# Altium schematic sheet rf_test_source_top.SchDoc: SPE Router (part 1 of 2)
size 420 x 297 mm; Author: P. Daniel; CompanyName: WUT ISE; DrawnBy: P. Daniel; Organization: WUT ISE; Address1: WUT ISE; Address2: Nowowiejska 15/19 00-665 Warsaw; Address3: piotrmaciejdaniel@gmail.com; Revision: 1; SheetNumber: 1; SheetTotal: 1; ModifiedBy: -; CreateDate: 02-03.2023; CheckedDate: -; Title2: top schematic; DivGrp: WUT ISE; Designer: Piotr Daniel
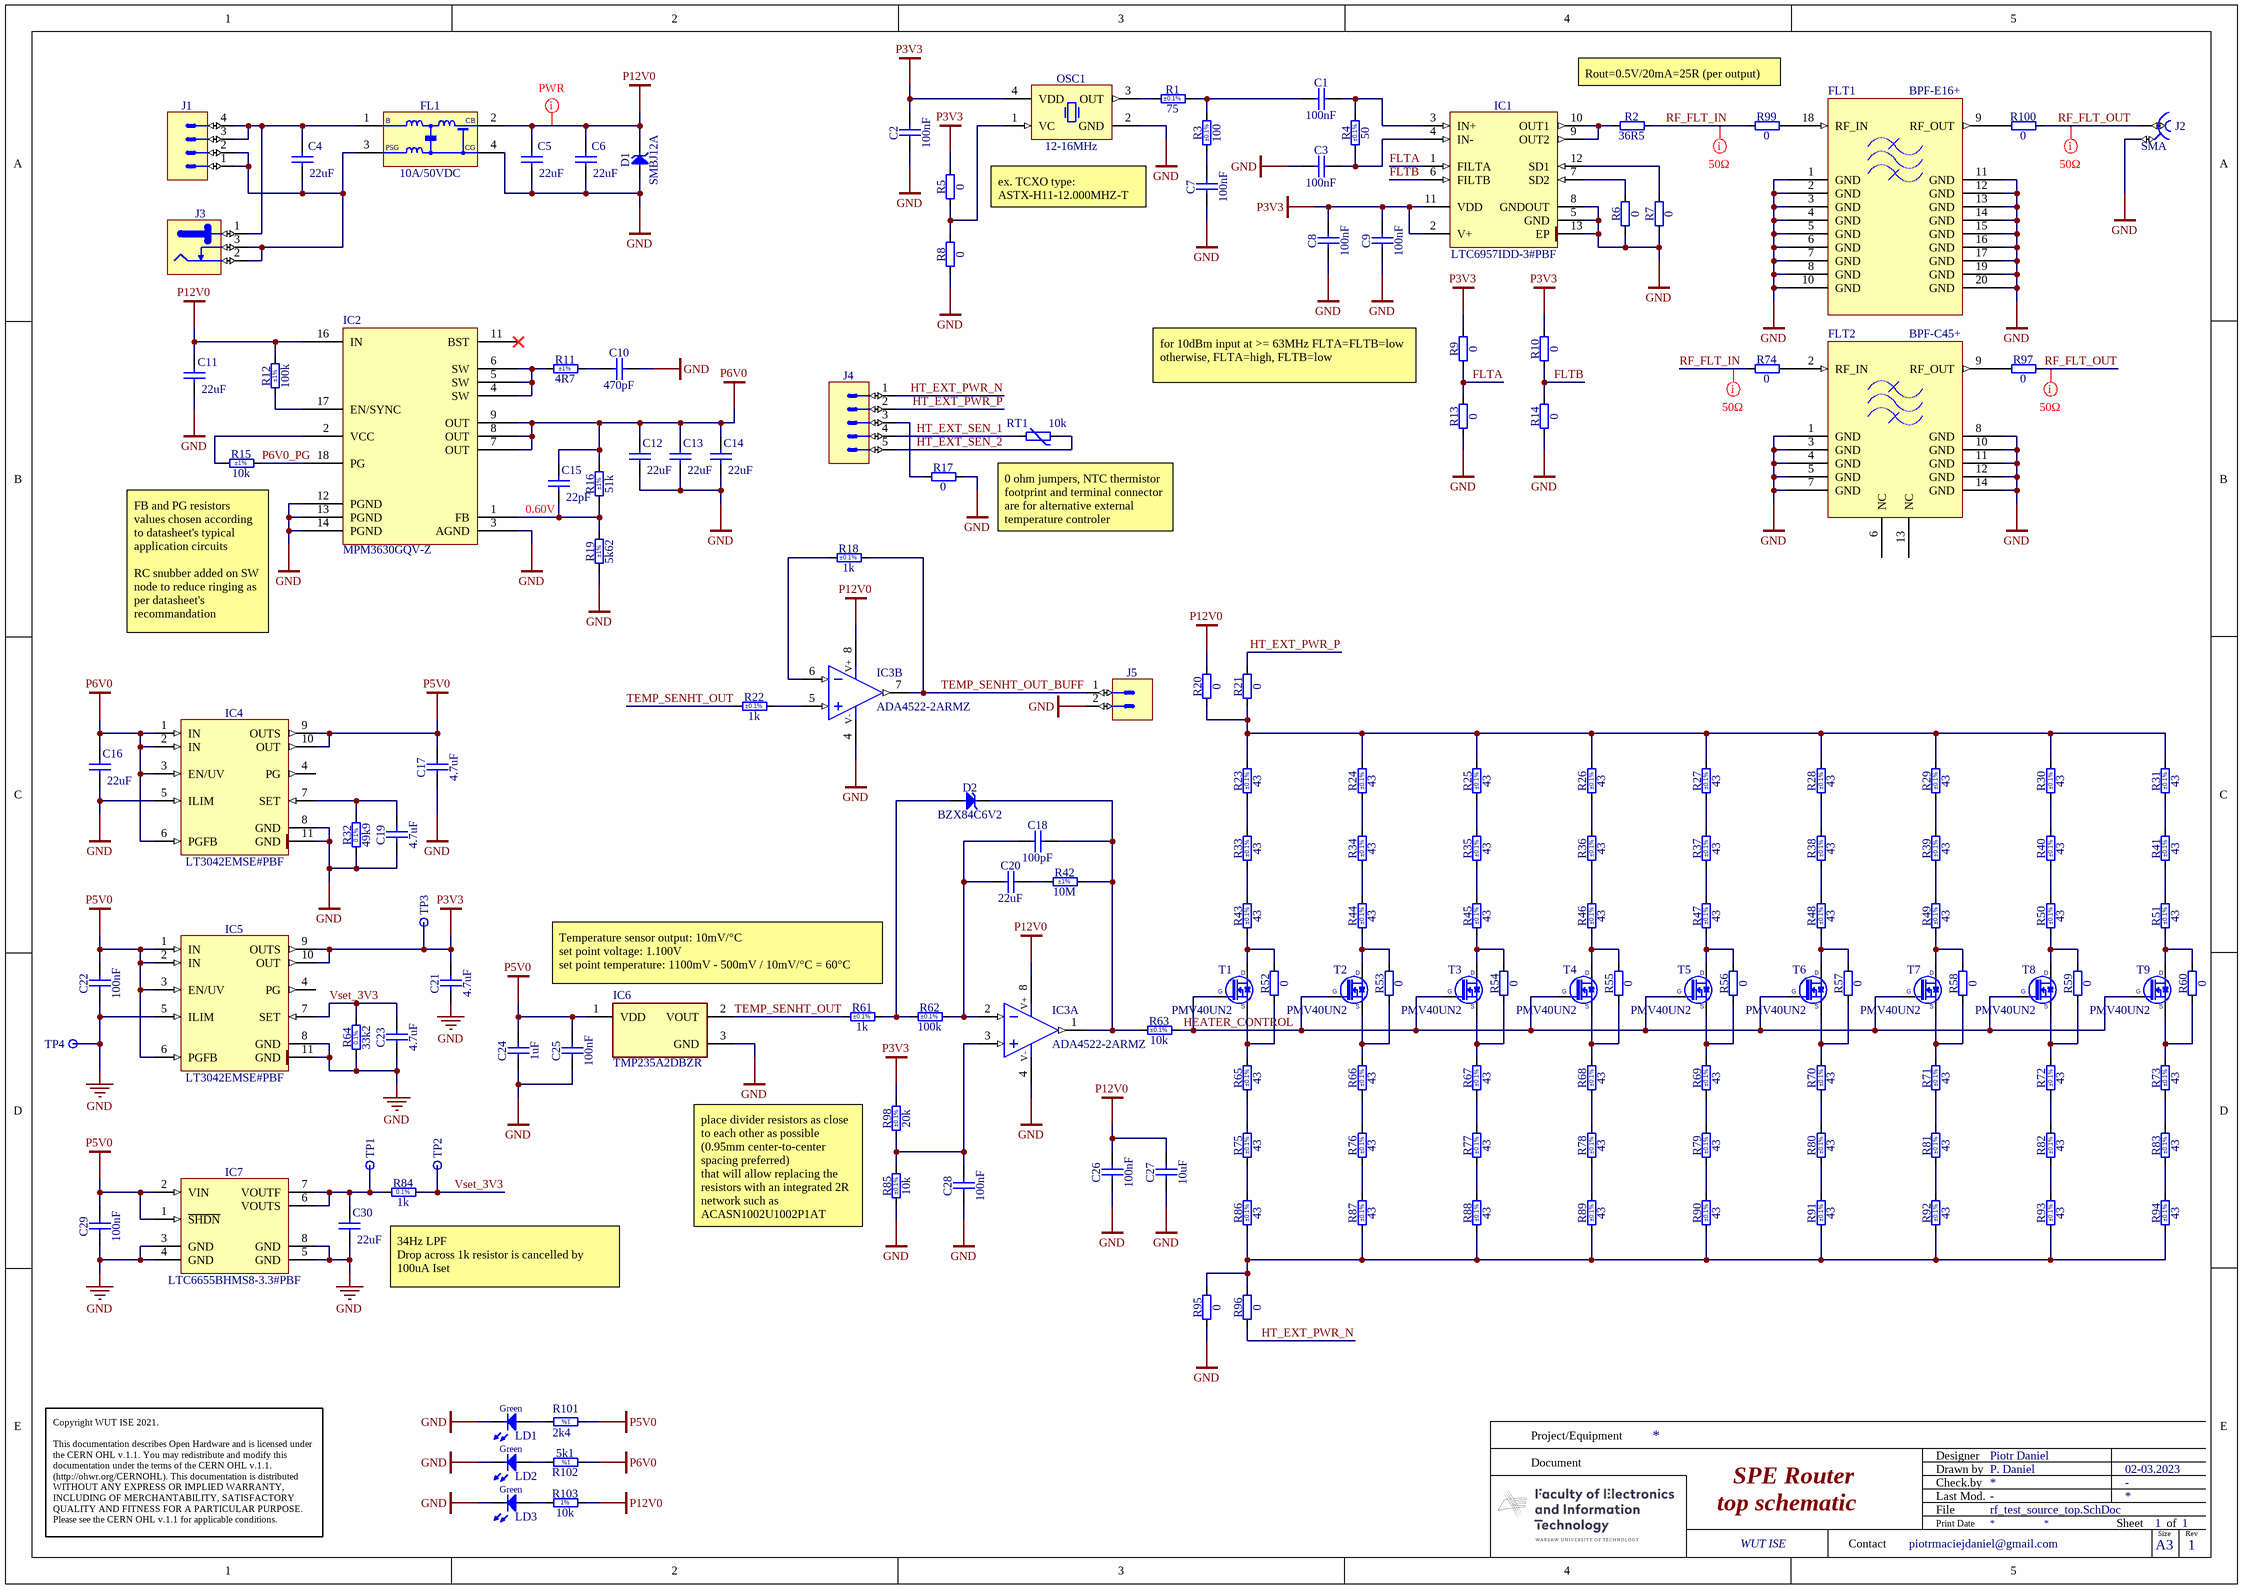
[diagram p0: rf_test_source_top.SchDoc]

## Parts
C1  100nF  [CAPC1608X87N]
C2  100nF  [CAPC1608X87N]
C3  100nF  [CAPC1608X87N]
C4  22uF  [CAPC3225X140N]
C5  22uF  [CAPC3225X140N]
C6  22uF  [CAPC3225X140N]
C7  100nF  [CAPC1608X87N]
C8  100nF  [CAPC1608X87N]
C9  100nF  [CAPC1608X87N]
C10  470pF  [CAPC1005X55N]
C11  22uF  [CAPC3225X140N]
C12  22uF  [CAPC3225X140N]
C13  22uF  [CAPC3225X140N]
C14  22uF  [CAPC3225X140N]
C15  22pF  [CAPC1005X55N]
C16  22uF  [CAPC3225X140N]
C17  4.7uF  [CAPC3216X180N]
C18  100pF  [CAPC1608X87N]
C19  4.7uF  [CAPC3216X180N]
C20  22uF  [CAPC2012X135N]
C21  4.7uF  [CAPC3216X180N]
C22  100nF  [CAPC1608X87N]
C23  4.7uF  [CAPC3216X180N]
C24  1uF  [CAPC1608X87N]
C25  100nF  [CAPC1005X55N]
C26  100nF  [CAPC1005X55N]
C27  10uF  [CAPC2012X135N]
C28  100nF  [CAPC1005X55N]
C29  100nF  [CAPC1608X87N]
C30  22uF  [CAPC3225X140N]
D1  SMBJ12A  [DIOM5336X265N]
D2  BZX84C6V2  [SOT95P248X115-3N]
FL1  10A/50VDC  [FIL_MURATA_BNX02]
FLT1  BPF-E16+  [HR1176]
FLT2  BPF-C45+  [HU1186]
IC1  LTC6957IDD-3#PBF  [SON45P300X300X80-13N-R175X248]
IC2  MPM3630GQV-Z  [MPM3610A]
IC3  ADA4522-2ARMZ  [SOP65P490X110-8N]  (parts A,B of 2)
IC4  LT3042EMSE#PBF  [SOP50P490X110-11N-R168X198]
IC5  LT3042EMSE#PBF  [SOP50P490X110-11N-R168X198]
IC6  TMP235A2DBZR  [FP-DBZ0003A-MFG]
IC7  LTC6655BHMS8-3.3#PBF  [SOP65P490X110-8N]
J1  Mini-Fit Jr.™  [MOLEX_39-30-0040]  (value not drawn)
J2  SMA  [MOLEX_73251-2121]
J3  Jack  [SWITCHCRAFT_712RA]  (value not drawn)
J4  (no value)  [PHOENIX_1803303]
J5  KK®  [MOLEX_22-05-7028]  (value not drawn)
LD1  Green  [LED_KINGBRIGHT_KPH-1608CGCK]
LD2  Green  [LED_KINGBRIGHT_KPH-1608CGCK]
LD3  Green  [LED_KINGBRIGHT_KPH-1608CGCK]
OSC1  12-16MHz  [OSC_TAITIEN_3.2X2.5X1.0]
R1  75  Tolerance: ±0.1%  [RESC1608X55N]
R2  36R5  [RESC1005X40N]
R3  100  Tolerance: ±0.1%  [RESC1608X64N]
R4  50  Tolerance: ±0.1%  [RES_VISHAY_FC0603]
R5  0  [RESC1608X55N]
R6  0  [RESC1608X55N]
R7  0  [RESC1608X55N]
R8  0  [RESC1608X55N]
R9  0  [RESC1608X55N]
R10  0  [RESC1608X55N]
R11  4R7  Tolerance: ±1%  [RESC1005X40N]
R12  100k  Tolerance: ±1%  [RESC1005X40N]
R13  0  [RESC1608X55N]
R14  0  [RESC1608X55N]
R15  10k  Tolerance: ±1%  [RESC1005X40N]
R16  51k  Tolerance: ±1%  [RESC1005X40N]
R17  0  [RESC2012X60N]
R18  1k  Tolerance: ±0.1%  [RESC1608X55N]
R19  5k62  Tolerance: ±1%  [RESC1005X40N]
R20  0  [RESC2012X60N]
R21  0  [RESC2012X60N]
R22  1k  Tolerance: ±0.1%  [RESC1608X55N]
R23  43  Tolerance: ±0.1%  [RESC3216X65N]
R24  43  Tolerance: ±0.1%  [RESC3216X65N]
R25  43  Tolerance: ±0.1%  [RESC3216X65N]
R26  43  Tolerance: ±0.1%  [RESC3216X65N]
R27  43  Tolerance: ±0.1%  [RESC3216X65N]
R28  43  Tolerance: ±0.1%  [RESC3216X65N]
R29  43  Tolerance: ±0.1%  [RESC3216X65N]
R30  43  Tolerance: ±0.1%  [RESC3216X65N]
R31  43  Tolerance: ±0.1%  [RESC3216X65N]
R32  49k9  [RESC1608X55N]
R33  43  Tolerance: ±0.1%  [RESC3216X65N]
R34  43  Tolerance: ±0.1%  [RESC3216X65N]
R35  43  Tolerance: ±0.1%  [RESC3216X65N]
R36  43  Tolerance: ±0.1%  [RESC3216X65N]
R37  43  Tolerance: ±0.1%  [RESC3216X65N]
R38  43  Tolerance: ±0.1%  [RESC3216X65N]
R39  43  Tolerance: ±0.1%  [RESC3216X65N]
R40  43  Tolerance: ±0.1%  [RESC3216X65N]
R41  43  Tolerance: ±0.1%  [RESC3216X65N]
R42  10M  Tolerance: ±1%  [RESC1608X55N]
R43  43  Tolerance: ±0.1%  [RESC3216X65N]
R44  43  Tolerance: ±0.1%  [RESC3216X65N]
R45  43  Tolerance: ±0.1%  [RESC3216X65N]
R46  43  Tolerance: ±0.1%  [RESC3216X65N]
R47  43  Tolerance: ±0.1%  [RESC3216X65N]
R48  43  Tolerance: ±0.1%  [RESC3216X65N]
R49  43  Tolerance: ±0.1%  [RESC3216X65N]
R50  43  Tolerance: ±0.1%  [RESC3216X65N]
R51  43  Tolerance: ±0.1%  [RESC3216X65N]
R52  0  [RESC1608X55N]
R53  0  [RESC1608X55N]
R54  0  [RESC1608X55N]
R55  0  [RESC1608X55N]
R56  0  [RESC1608X55N]
R57  0  [RESC1608X55N]
R58  0  [RESC1608X55N]
R59  0  [RESC1608X55N]
R60  0  [RESC1608X55N]
R61  1k  Tolerance: ±0.1%  [RESC1608X55N]
R62  100k  Tolerance: ±0.1%  [RESC1608X55N]
R63  10k  Tolerance: ±0.1%  [RESC1608X55N]
R64  33k2  [RESC1608X55N]
R65  43  Tolerance: ±0.1%  [RESC3216X65N]
R66  43  Tolerance: ±0.1%  [RESC3216X65N]
R67  43  Tolerance: ±0.1%  [RESC3216X65N]
R68  43  Tolerance: ±0.1%  [RESC3216X65N]
R69  43  Tolerance: ±0.1%  [RESC3216X65N]
R70  43  Tolerance: ±0.1%  [RESC3216X65N]
R71  43  Tolerance: ±0.1%  [RESC3216X65N]
R72  43  Tolerance: ±0.1%  [RESC3216X65N]
R73  43  Tolerance: ±0.1%  [RESC3216X65N]
R74  0  [RESC1005X40N]
R75  43  Tolerance: ±0.1%  [RESC3216X65N]
R76  43  Tolerance: ±0.1%  [RESC3216X65N]
R77  43  Tolerance: ±0.1%  [RESC3216X65N]
R78  43  Tolerance: ±0.1%  [RESC3216X65N]
R79  43  Tolerance: ±0.1%  [RESC3216X65N]
R80  43  Tolerance: ±0.1%  [RESC3216X65N]
R81  43  Tolerance: ±0.1%  [RESC3216X65N]
R82  43  Tolerance: ±0.1%  [RESC3216X65N]
R83  43  Tolerance: ±0.1%  [RESC3216X65N]
R84  1k  [RESC1608X55N]
R85  10k  Tolerance: ±0.1%  [RESC1608X55N]
R86  43  Tolerance: ±0.1%  [RESC3216X65N]
R87  43  Tolerance: ±0.1%  [RESC3216X65N]
R88  43  Tolerance: ±0.1%  [RESC3216X65N]
R89  43  Tolerance: ±0.1%  [RESC3216X65N]
R90  43  Tolerance: ±0.1%  [RESC3216X65N]
R91  43  Tolerance: ±0.1%  [RESC3216X65N]
R92  43  Tolerance: ±0.1%  [RESC3216X65N]
R93  43  Tolerance: ±0.1%  [RESC3216X65N]
R94  43  Tolerance: ±0.1%  [RESC3216X65N]
R95  0  [RESC2012X60N]
R96  0  [RESC2012X60N]
R97  0  [RESC1005X40N]
R98  20k  Tolerance: ±0.1%  [RESC1608X55N]
R99  0  [RESC1005X40N]
R100  0  [RESC1005X40N]
R101  2k4  [RESC1005X40N]
R102  5k1  [RESC1005X40N]
R103  10k  [RESC1005X40N]
RT1  10k  [THERMC1608X90N]
T1  PMV40UN2  [SOT95P230X110-3N]
T2  PMV40UN2  [SOT95P230X110-3N]
T3  PMV40UN2  [SOT95P230X110-3N]
T4  PMV40UN2  [SOT95P230X110-3N]
T5  PMV40UN2  [SOT95P230X110-3N]
T6  PMV40UN2  [SOT95P230X110-3N]
T7  PMV40UN2  [SOT95P230X110-3N]
T8  PMV40UN2  [SOT95P230X110-3N]
T9  PMV40UN2  [SOT95P230X110-3N]
TP1  Test Point  [TPS127]  (value not drawn)
TP2  Test Point  [TPS127]  (value not drawn)
TP3  Test Point  [TPS127]  (value not drawn)
TP4  Test Point  [TPS127]  (value not drawn)

## Nets
GND: C2.1 C3.1 C5.1 C6.1 C7.1 C8.1 C9.1 C10.2 C11.1 C12.1 C13.1 C14.1 C16.1 C17.1 C19.1 C21.1 C22.1 C23.1 C24.1 C25.1 C26.1 C27.1 C28.1 C29.1 C30.1 D1.2(A) FL1.4(CG) FLT1.1(GND) FLT1.2(GND) FLT1.3(GND) FLT1.4(GND) FLT1.5(GND) FLT1.6(GND) FLT1.7(GND) FLT1.8(GND) FLT1.10(GND) FLT1.11(GND) FLT1.12(GND) FLT1.13(GND) FLT1.14(GND) FLT1.15(GND) FLT1.16(GND) FLT1.17(GND) FLT1.19(GND) FLT1.20(GND) FLT2.1(GND) FLT2.3(GND) FLT2.4(GND) FLT2.5(GND) FLT2.7(GND) FLT2.8(GND) FLT2.10(GND) FLT2.11(GND) FLT2.12(GND) FLT2.14(GND) IC1.5(GND) IC1.8(GNDOUT) IC1.13(EP) IC2.3(AGND) IC2.12(PGND) IC2.13(PGND) IC2.14(PGND) IC3.4(V-) IC4.5(ILIM) IC4.8(GND) IC4.11(GND) IC5.5(ILIM) IC5.8(GND) IC5.11(GND) IC6.3(GND) IC7.3(GND) IC7.4(GND) IC7.5(GND) IC7.8(GND) J2.2 J5.2 LD1.1(C) LD2.1(C) LD3.1(C) OSC1.2(GND) R6.1 R7.1 R8.1 R13.1 R14.1 R17.2 R19.1 R32.1 R64.1 R85.1 R95.1 TP4.1
P3V3: C2.2 C8.2 C9.2 C21.2 IC1.2(V+) IC1.11(VDD) IC5.9(OUTS) IC5.10(OUT) OSC1.4(VDD) R5.2 R9.2 R10.2 R98.2 TP3.1
P5V0: C17.2 C22.2 C24.2 C25.2 C29.2 IC4.9(OUTS) IC4.10(OUT) IC5.1(IN) IC5.2(IN) IC5.3(EN/UV) IC5.6(PGFB) IC6.1(VDD) IC7.1(~{SHDN}) IC7.2(VIN) R101.1
P6V0: C12.2 C13.2 C14.2 C15.2 C16.2 IC2.7(OUT) IC2.8(OUT) IC2.9(OUT) IC4.1(IN) IC4.2(IN) IC4.3(EN/UV) IC4.6(PGFB) R16.2 R102.1
P12V0: C5.2 C6.2 C11.2 C26.2 C27.2 D1.1(C) FL1.2(CB) IC2.16(IN) IC3.8(V+) R12.2 R20.2 R103.2
FLTA: IC1.1(FILTA) R9.1 R13.2
FLTB: IC1.6(FILTB) R10.1 R14.2
HEATER_CONTROL: R63.2 T1.1(G) T2.1(G) T3.1(G) T4.1(G) T5.1(G) T6.1(G) T7.1(G) T8.1(G) T9.1(G)
HT_EXT_PWR_N: J4.1 R96.1
HT_EXT_PWR_P: J4.2 R21.2
HT_EXT_SEN_1: J4.4 RT1.1
HT_EXT_SEN_2: J4.5 RT1.2
P6V0_PG: IC2.18(PG) R15.2
RF_FLT_IN: R2.2 R74.1 R99.1
RF_FLT_OUT: J2.1 R97.2 R100.2
TEMP_SENHT_OUT: IC6.2(VOUT) R22.1 R61.1
TEMP_SENHT_OUT_BUFF: IC3.7(OUT) J5.1 R18.2
Vset_3V3: C23.2 IC5.7(SET) R64.2 R84.2 TP2.1
NetC1_1: C1.1 R1.2 R3.2
NetC1_2: C1.2 IC1.3(IN+) R4.2
NetC3_2: C3.2 IC1.4(IN-) R4.1
NetC4_1: C4.1 FL1.3(PSG) J1.1 J1.2 J3.2 J3.3
NetC4_2: C4.2 FL1.1(B) J1.3 J1.4 J3.1
NetC7_2: C7.2 R3.1
NetC10_1: C10.1 R11.2
NetC15_1: C15.1 IC2.1(FB) R16.1 R19.2
NetC18_1: C18.1 C20.1 IC3.2(IN-) R62.2
NetC18_2: C18.2 D2.3(C) IC3.1(OUT) R42.2 R63.1
NetC19_2: C19.2 IC4.7(SET) R32.2
NetC20_2: C20.2 R42.1
NetC28_2: C28.2 IC3.3(IN+) R85.2 R98.1
NetC30_2: C30.2 IC7.6(VOUTS) IC7.7(VOUTF) R84.1 TP1.1
NetD2_1: D2.1(A) R61.2 R62.1
NetFLT1_9: FLT1.9(RF_OUT) R100.1
NetFLT1_18: FLT1.18(RF_IN) R99.2
NetFLT2_2: FLT2.2(RF_IN) R74.2
NetFLT2_9: FLT2.9(RF_OUT) R97.1
NetIC1_7: IC1.7(SD2) R6.2
NetIC1_9: IC1.9(OUT2) IC1.10(OUT1) R2.1
NetIC1_12: IC1.12(SD1) R7.2
NetIC2_2: IC2.2(VCC) R15.1
NetIC2_4: IC2.4(SW) IC2.5(SW) IC2.6(SW) R11.1
NetIC2_17: IC2.17(EN/SYNC) R12.1
NetIC3_5: IC3.5(IN+) R22.2
NetIC3_6: IC3.6(IN-) R18.1
NetJ4_3: J4.3 R17.1
NetLD1_2: LD1.2(A) R101.2
NetLD2_2: LD2.2(A) R102.2
NetLD3_2: LD3.2(A) R103.1
NetOSC1_1: OSC1.1(VC) R5.1 R8.2
NetOSC1_3: OSC1.3(OUT) R1.1
NetR20_1: R20.1 R21.1 R23.2 R24.2 R25.2 R26.2 R27.2 R28.2 R29.2 R30.2 R31.2
NetR23_1: R23.1 R33.2
NetR24_1: R24.1 R34.2
NetR25_1: R25.1 R35.2
NetR26_1: R26.1 R36.2
NetR27_1: R27.1 R37.2
NetR28_1: R28.1 R38.2
NetR29_1: R29.1 R39.2
NetR30_1: R30.1 R40.2
NetR31_1: R31.1 R41.2
NetR33_1: R33.1 R43.2
NetR34_1: R34.1 R44.2
NetR35_1: R35.1 R45.2
NetR36_1: R36.1 R46.2
NetR37_1: R37.1 R47.2
NetR38_1: R38.1 R48.2
NetR39_1: R39.1 R49.2
NetR40_1: R40.1 R50.2
NetR41_1: R41.1 R51.2
NetR43_1: R43.1 R52.2 T1.3(D)
NetR44_1: R44.1 R53.2 T2.3(D)
NetR45_1: R45.1 R54.2 T3.3(D)
NetR46_1: R46.1 R55.2 T4.3(D)
NetR47_1: R47.1 R56.2 T5.3(D)
NetR48_1: R48.1 R57.2 T6.3(D)
NetR49_1: R49.1 R58.2 T7.3(D)
NetR50_1: R50.1 R59.2 T8.3(D)
NetR51_1: R51.1 R60.2 T9.3(D)
NetR52_1: R52.1 R65.2 T1.2(S)
NetR53_1: R53.1 R66.2 T2.2(S)
NetR54_1: R54.1 R67.2 T3.2(S)
NetR55_1: R55.1 R68.2 T4.2(S)
NetR56_1: R56.1 R69.2 T5.2(S)
NetR57_1: R57.1 R70.2 T6.2(S)
NetR58_1: R58.1 R71.2 T7.2(S)
NetR59_1: R59.1 R72.2 T8.2(S)
NetR60_1: R60.1 R73.2 T9.2(S)
NetR65_1: R65.1 R75.2
NetR66_1: R66.1 R76.2
NetR67_1: R67.1 R77.2
NetR68_1: R68.1 R78.2
NetR69_1: R69.1 R79.2
NetR70_1: R70.1 R80.2
NetR71_1: R71.1 R81.2
NetR72_1: R72.1 R82.2
NetR73_1: R73.1 R83.2
NetR75_1: R75.1 R86.2
NetR76_1: R76.1 R87.2
NetR77_1: R77.1 R88.2
NetR78_1: R78.1 R89.2
NetR79_1: R79.1 R90.2
NetR80_1: R80.1 R91.2
NetR81_1: R81.1 R92.2
NetR82_1: R82.1 R93.2
NetR83_1: R83.1 R94.2
NetR86_1: R86.1 R87.1 R88.1 R89.1 R90.1 R91.1 R92.1 R93.1 R94.1 R95.2 R96.2

Not connected (* = marked no-connect by the designer): FLT2 6(NC) 13(NC); IC2 11(BST)*; IC4 4(PG); IC5 4(PG)

## Layout directives
net class 50Ohm: RF_FLT_IN, RF_FLT_OUT
net class PWR: P12V0

## Notes on the sheet
- Rout=0.5V/20mA=25R (per output)
- ex. TCXO type:
  ASTX-H11-12.000MHZ-T
- for 10dBm input at >= 63MHz FLTA=FLTB=low
  otherwise, FLTA=high, FLTB=low
- (near C15) 0.60V
- 0 ohm jumpers, NTC thermistor footprint and terminal connector are for alternative external temperature controler
- (near R15) FB and PG resistors values chosen according to datasheet's typical application circuits
  RC snubber added on SW node to reduce ringing as per datasheet's recommandation
- Temperature sensor output: 10mV/°C
  set point voltage: 1.100V
  set point temperature: 1100mV - 500mV / 10mV/°C = 60°C
- place divider resistors as close to each other as possible (0.95mm center-to-center spacing preferred)
  that will allow replacing the resistors with an integrated 2R network such as ACASN1002U1002P1AT
- 34Hz LPF
  Drop across 1k resistor is cancelled by 100uA Iset
- Project/Equipment
- Document
- Designer
- Drawn by
- Check.by
- Copyright WUT ISE 2021.
  This documentation describes Open Hardware and is licensed under the CERN OHL v.1.1. You may redistribute and modify this documentation under the terms of the CERN OHL v.1.1. (http://ohwr.org/CERNOHL). This documentation is distributed WITHOUT ANY EXPRESS OR IMPLIED WARRANTY, INCLUDING OF MERCHANTABILITY, SATISFACTORY QUALITY AND FITNESS FOR A PARTICULAR PURPOSE. Please see the CERN OHL v.1.1 for applicable conditions.
- Contact
- File
- Last Mod.
- Print Date
- Sheet
- Size
- A3
- of
- Rev
- (in symbol R0402_2K4_1%_0.0625W_100PPM) 1%
- (in symbol R0402_5K1_1%_0.0625W_100PPM) 1%
- (in symbol R0402_10K_1%_0.0625W_100PPM) 1%
- (in symbol R0603_1K_0.1%_0.063W_10PPM) 0.1%
- (in symbol R0603_33K2_0.1%_0.063W_10PPM) 0.1%
- (in symbol R0603_49K9_0.1%_0.063W_10PPM) 0.1%